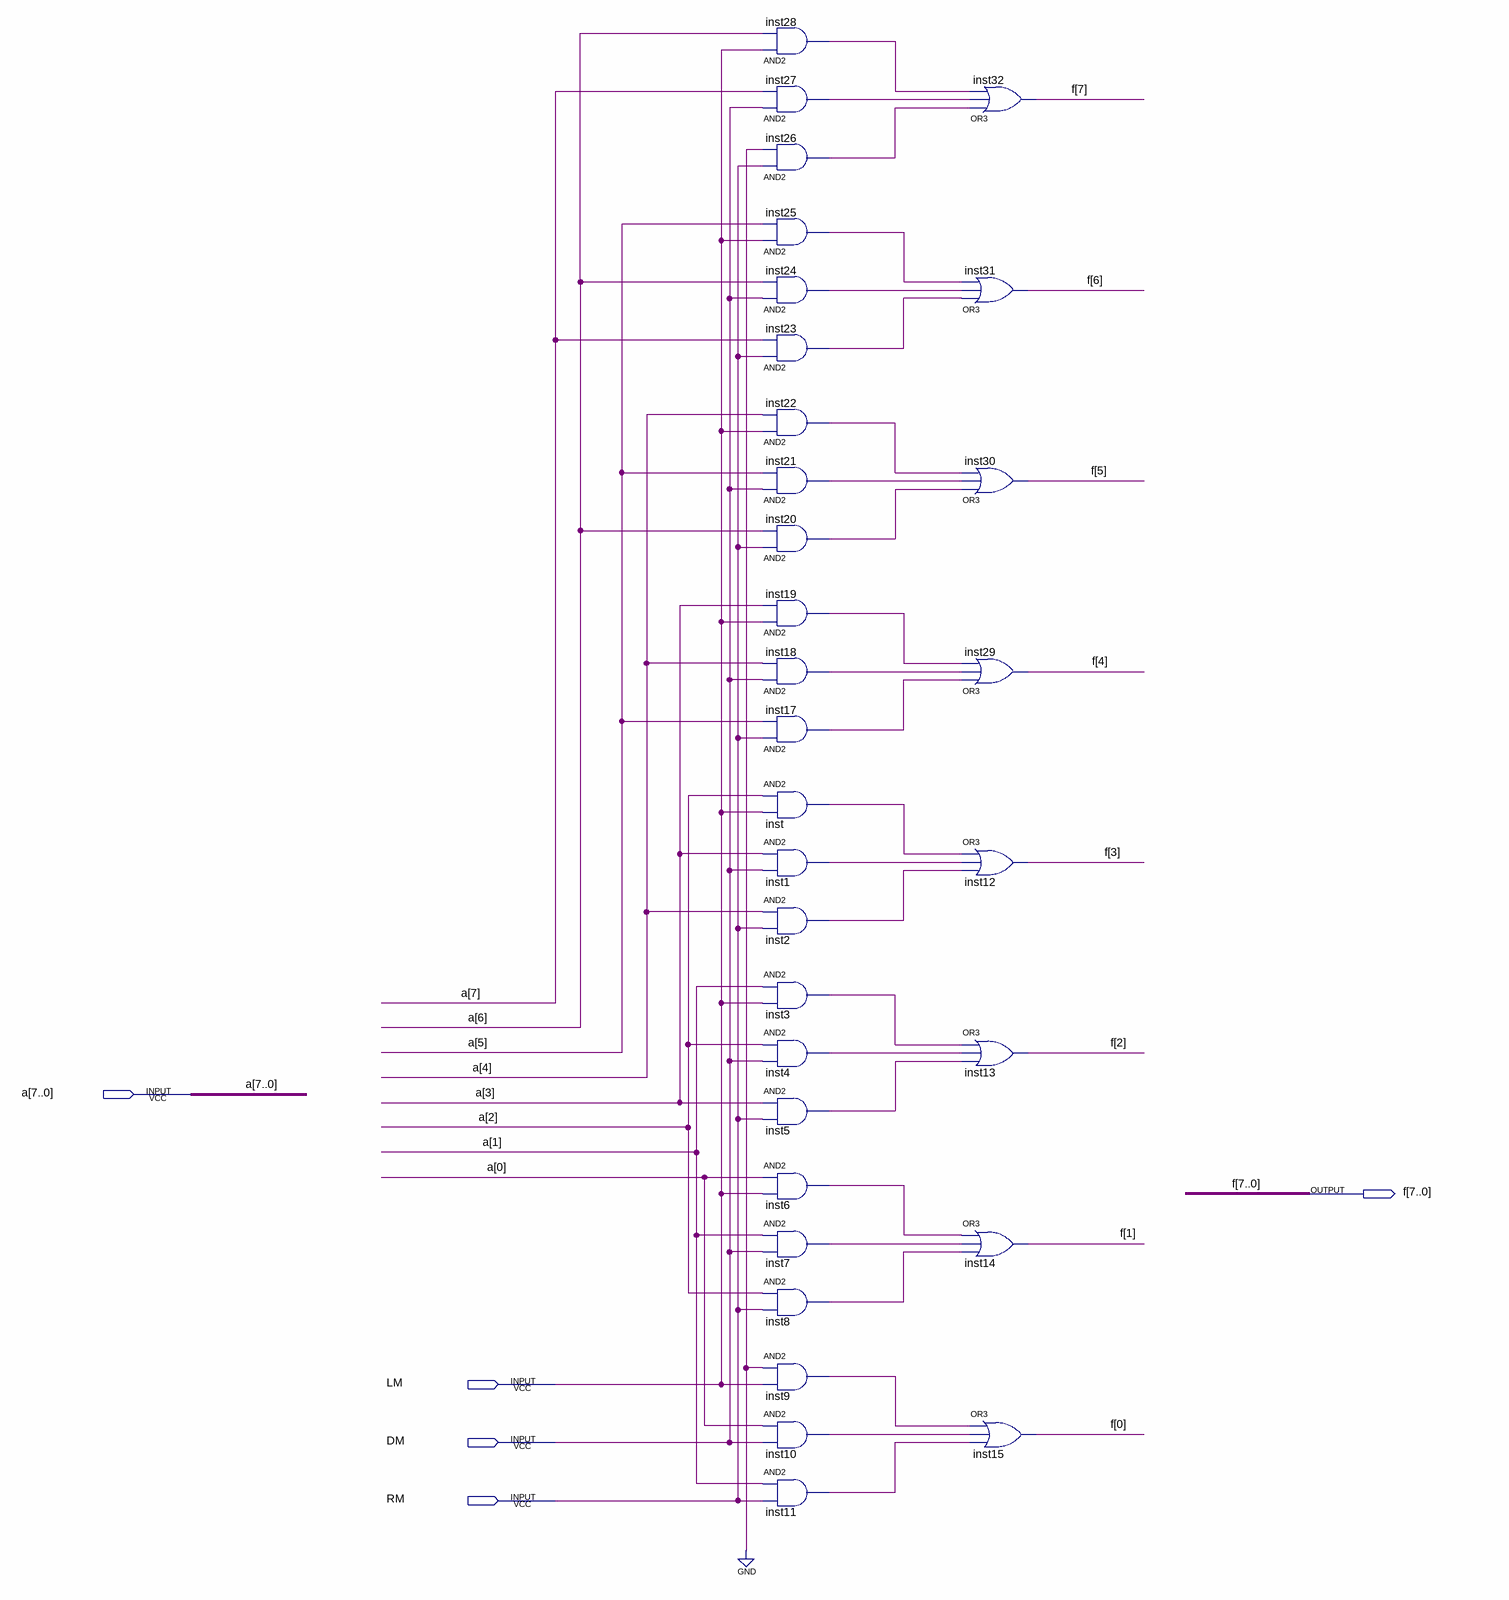
[diagram p0: schematic sheet]
// Quartus schematic shifter.bdf as structural Verilog: 32 symbols, 5 pins
module shifter (
  input  [7:0] a,
  input  LM,
  input  DM,
  input  RM,
  output [7:0] f
);

  wire inst1_out, inst2_out, inst3_out, inst4_out, inst5_out, inst6_out, inst7_out, inst8_out, inst9_out,
       inst10_out, inst11_out, inst17_out, inst18_out, inst19_out, inst20_out, inst21_out, inst22_out,
       inst23_out, inst24_out, inst25_out, inst26_out, inst27_out, inst28_out, inst_out;

  and inst28 (inst28_out, LM, a[6]);
  and inst27 (inst27_out, DM, a[7]);
  and inst26 (inst26_out, RM, 1'b0);
  and inst25 (inst25_out, LM, a[5]);
  and inst24 (inst24_out, DM, a[6]);
  and inst23 (inst23_out, RM, a[7]);
  and inst22 (inst22_out, LM, a[4]);
  and inst21 (inst21_out, DM, a[5]);
  and inst20 (inst20_out, RM, a[6]);
  and inst19 (inst19_out, LM, a[3]);
  and inst18 (inst18_out, DM, a[4]);
  and inst17 (inst17_out, RM, a[5]);
  and inst (inst_out, a[2], LM);
  and inst1 (inst1_out, a[3], DM);
  and inst2 (inst2_out, a[4], RM);
  and inst3 (inst3_out, a[1], LM);
  and inst4 (inst4_out, a[2], DM);
  and inst5 (inst5_out, a[3], RM);
  and inst6 (inst6_out, a[0], LM);
  and inst7 (inst7_out, a[1], DM);
  and inst8 (inst8_out, a[2], RM);
  and inst9 (inst9_out, 1'b0, LM);
  and inst10 (inst10_out, a[0], DM);
  and inst11 (inst11_out, a[1], RM);
  or inst32 (f[7], inst26_out, inst27_out, inst28_out);
  or inst31 (f[6], inst23_out, inst24_out, inst25_out);
  or inst30 (f[5], inst20_out, inst21_out, inst22_out);
  or inst29 (f[4], inst17_out, inst18_out, inst19_out);
  or inst12 (f[3], inst_out, inst1_out, inst2_out);
  or inst13 (f[2], inst3_out, inst4_out, inst5_out);
  or inst14 (f[1], inst6_out, inst7_out, inst8_out);
  or inst15 (f[0], inst9_out, inst10_out, inst11_out);
endmodule
